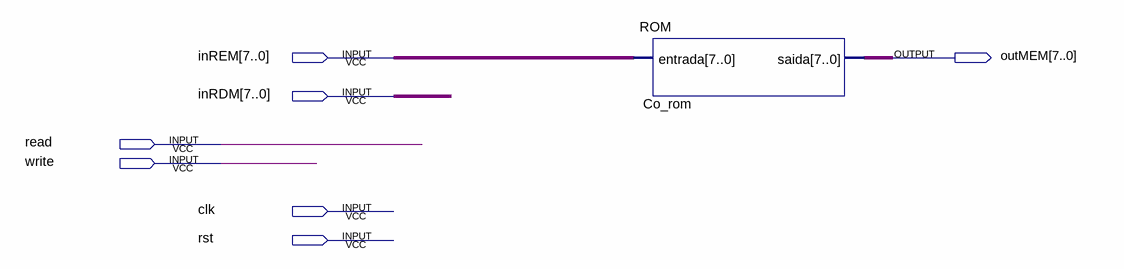
[diagram p0: schematic sheet]
// Quartus schematic mem.bdf as structural Verilog: 1 symbols, 7 pins
module mem (
  input  [7:0] inREM,
  input  [7:0] inRDM,
  input  read,
  input  write,
  input  clk,
  input  rst,
  output [7:0] outMEM
);

  ROM Co_rom (.entrada(inREM), .saida(outMEM));
endmodule
